# Altium schematic sheet master_sheet.SchDoc
size A4
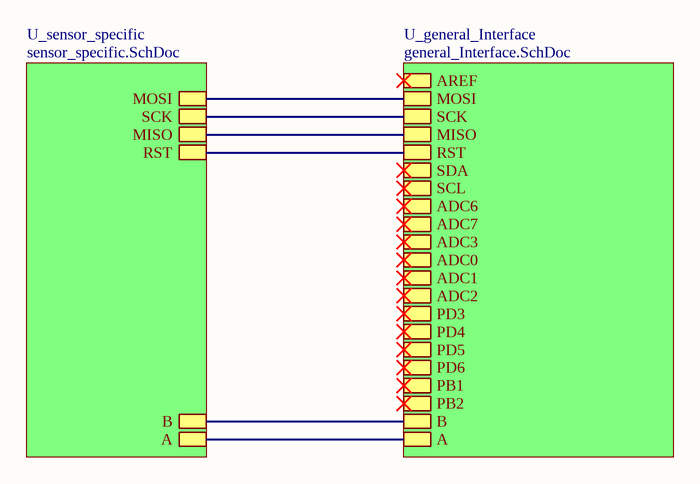
[diagram p0: master_sheet.SchDoc]

## Sub-sheets
U_general_Interface = general_Interface.SchDoc: AREF, MOSI, SCK, MISO, RST, SDA, SCL, ADC6, ADC7, ADC3, ADC0, ADC1, ADC2, PD3, PD4, PD5, PD6, PB1, PB2, B, A
U_sensor_specific = sensor_specific.SchDoc: MOSI, SCK, MISO, RST, B, A

## Nets
(unnamed): sheet U_general_Interface/MOSI, sheet U_sensor_specific/MOSI
(unnamed): sheet U_general_Interface/SCK, sheet U_sensor_specific/SCK
(unnamed): sheet U_general_Interface/MISO, sheet U_sensor_specific/MISO
(unnamed): sheet U_general_Interface/RST, sheet U_sensor_specific/RST
(unnamed): sheet U_general_Interface/B, sheet U_sensor_specific/B
(unnamed): sheet U_general_Interface/A, sheet U_sensor_specific/A